# Altium project Touch_sensor.PrjPcb
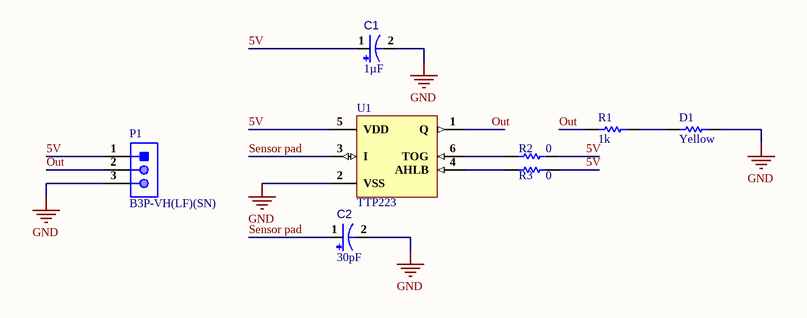
[diagram p0:  Touch_pad.SchDoc]
1 sheet, 8 parts. Net scope: global (net labels, ports and power ports of the same name join across sheets).
Board files:  Touch_pad_PCB.PcbDoc,  Manual_Print.PcbDoc

## Sheet  Touch_pad.SchDoc
size 254 x 208 mm; Date: 24/12/2023; CheckedBy: Tinh Chau; DrawnBy: Tinh Chau; Revision: Rev-01; SheetNumber: 1; SheetTotal: 1

### Parts
C1  value 1µF  [CAPC0805(2012)145_L]  (hidden comment: Capacitor 1 uF +/- 10% 25 V 0805)
C2  value 30pF  [CAPC0805(2012)145_L]  (hidden comment: Capacitor 1 uF +/- 10% 25 V 0805)
D1  value Yellow  [RESC0805(2012)_L]  (hidden comment: Resistor 1k +/-1% 0805 125 mW)
P1  B3P-VH(LF)(SN)  [JST-B3P-VH(LF)(SN)-3_V]
R1  value 1k  [RESC0805(2012)_L]  (hidden comment: Resistor 1k +/-1% 0805 125 mW)
R2  value 0  [RESC0805(2012)_L]  (hidden comment: Resistor 0R +/- 1% 0805 125 mW)
R3  value 0  [RESC0805(2012)_L]  (hidden comment: Resistor 0R +/- 1% 0805 125 mW)
U1  TTP223  [TTP223-SOT-23-6L]

### Nets
GND: C1.2 C2.2 D1.2 P1.3 U1.2(VSS)
5V: C1.1 P1.1 R2.2 R3.2 U1.5(VDD)
Out: P1.2 R1.1 U1.1(Q)
Sensor pad: C2.1 U1.3(I)
NetD1_1: D1.1 R1.2
NetR2_1: R2.1 U1.6(TOG)
NetR3_1: R3.1 U1.4(AHLB)

### Notes on the sheet
- Title
- Size
- Date:
- A4
- Number
- Check by:
- Revision
- Sheet of:
- Draw by:

### Library data of the parts
C1 C2 = CMP-001-00010-9: Chip Capacitor, 1 uF, +/-10%, 25 V, 0805 (2012 Metric); Voltage Rating: 25V; Capacitor Type: Ceramic; Supplier Locally Name: Thegioiic; Pins: 2; Case/Package: 0805; Mounting Technology: SM; Min Operating Temperature: -55°C; RoHS Compliant: True; Tolerance: 10%; Max Operating Temperature: 125°C; Supplier Locally URL: https://www.thegioiic.com/tu-gom-0805-1uf-25v
D1 R1 = CMP-009-00010-7: Chip Resistor, 1 KOhm, +/- 1%, 0.125 W, -55 to 155 degC, 0805 (2013 Metric); Power: 125mW; Voltage Rating: 150V; Pins: 2; Mounting Technology: SM; Case/Package: 0805; Min Operating Temperature: -55°C; RoHS Compliant: True; Tolerance: 1%; Max Operating Temperature: 155°C
P1 = CMP-002-00026-2: Male Header, Pitch 3.96 mm, 1 x 3 Position, Height 10.9 mm, Tail Length 3.7 mm, -25 to 85 degC, RoHS, Bulk; Manufacturer: JST; Case/Package: B3P-VH(LF)(SN); Connector Type: Header; Datasheet Version: May-16; Mounting Technology: TH; Package Description: Male Header, Pitch 3.96 mm, 1 x 3 Position, Height 10.9 mm, Tail Length 3.7 mm; Gender: Male; Manufacturer URL: http://www.jst.com/home2.html; Package Reference: B3P-VH(LF)(SN); Datasheet URL: http://www.jst-mfg.com/product/pdf/eng/eVH.pdf; Min Operating Temperature: -25°C; Max Operating Temperature: 85°C; RoHS Compliant: Unknown
R2 R3 = CMP-009-00001-7: Chip Resistor, 0 Ohm, +/- 1%, 125 mW, -55 to 155 degC, 0805 (2012 Metric); Voltage Rating: 150V; Power: 125mW; RoHS Compliant: True; Max Operating Temperature: 155°C; Case/Package: 0805; Pins: 2; Min Operating Temperature: -55°C; Mounting Technology: SM; Tolerance: 1%
U1 = CMP-010-00024-1: The TTP223-BA6/TTP223N-BA6 TonTouchTM is a touch pad detector IC; Sensor Type: Touch sensor; Nominal Supply Current: 3µA; Nominal Supply Voltage: 5V; Min Supply Voltage: 2V; Max Supply Voltage: 5.5V; Output Current: 8mA; Mounting Technology: SMT; Pins: 6; Max Operating Temperature: 85°C; Min Operating Temperature: -40°C; RoHS Compliant: Yes; Case/Package: SOT-23-6L